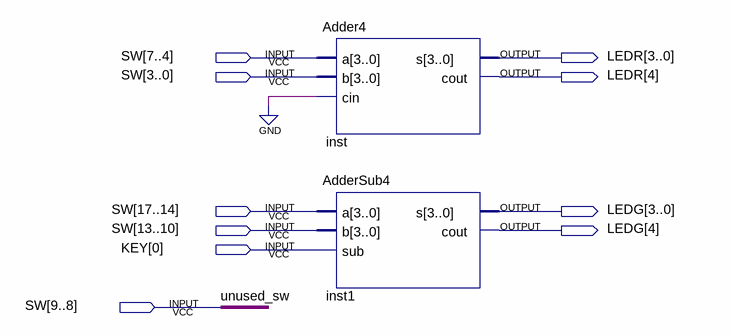
[diagram p0: schematic sheet]
// Quartus schematic AdderDemo.bdf as structural Verilog: 2 symbols, 10 pins
module AdderDemo (
  input  [17:0] SW,
  input  [0:0] KEY,
  output [4:0] LEDR,
  output [4:0] LEDG
);

  Adder4 inst (.a(SW[7:4]), .b(SW[3:0]), .cin(1'b0), .s(LEDR[3:0]), .cout(LEDR[4]));
  AdderSub4 inst1 (.a(SW[17:14]), .b(SW[13:10]), .sub(KEY[0]), .s(LEDG[3:0]), .cout(LEDG[4]));
endmodule
